# EAGLE design Jalousie_DC_up (EAGLE 5.00)
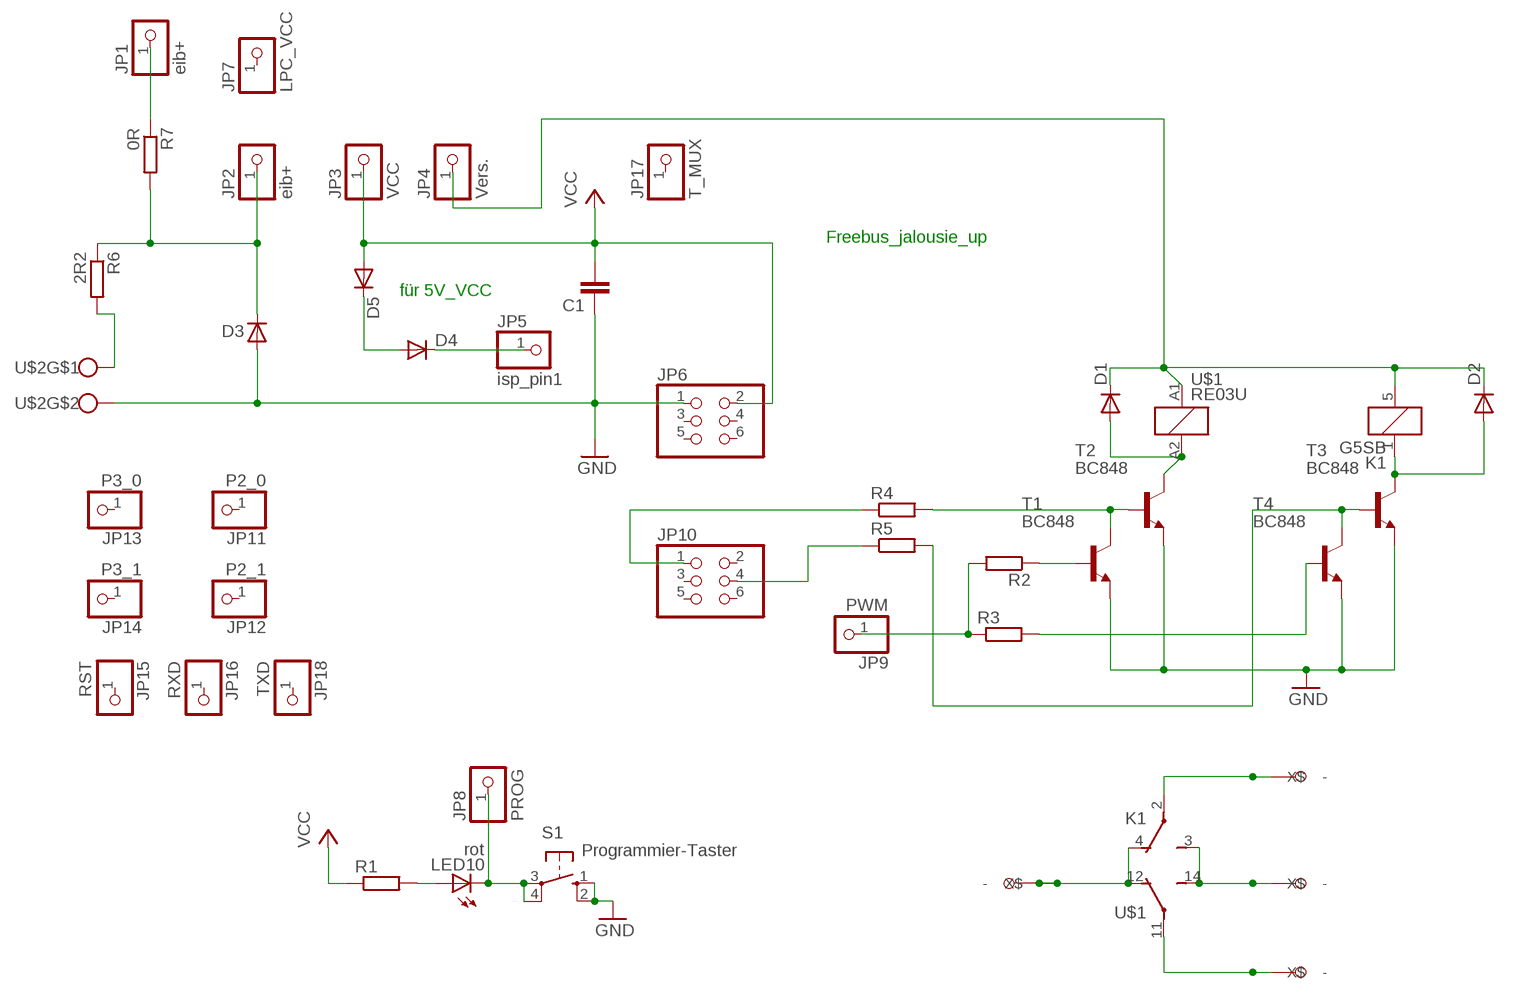
[diagram p0: schematic, sheet 1]

## Parts
C1  C-EUC1206  [C1206]
D1  DIODE-MINIMELF  [MINIMELF]
D2  DIODE-MINIMELF  [MINIMELF]
D3  D-  [SMA]
D4  DIODE-MINIMELF  [MINIMELF]
D5  DIODE-MINIMELF  [MINIMELF]
DOWN  +UB  SCHRAUBKLEMME  [SCHRAUBKLEMME_PAC]
JP1  eib+  PINHD-1X1  [1X01]
JP2  eib+  PINHD-1X1  [1X01]
JP3  VCC  PINHD-1X1  [1X01]
JP4  Vers.  PINHD-1X1  [1X01]
JP5  isp_pin1  PINHD-1X1  [1X01]
JP6  PINHD-2X3  [2X03]
JP7  LPC_VCC  PINHD-1X1  [1X01]
JP8  PROG  PINHD-1X1  [1X01]
JP9  PWM  PINHD-1X1  [1X01]
JP10  PINHD-2X3  [2X03]
JP11  P2_0  PINHD-1X1  [1X01]
JP12  P2_1  PINHD-1X1  [1X01]
JP13  P3_0  PINHD-1X1  [1X01]
JP14  P3_1  PINHD-1X1  [1X01]
JP15  RST  PINHD-1X1  [1X01]
JP16  RXD  PINHD-1X1  [1X01]
JP17  T_MUX  PINHD-1X1  [1X01]
JP18  TXD  PINHD-1X1  [1X01]
K1  G5SB  [G5SB]
L1  -UB  SCHRAUBKLEMME  [SCHRAUBKLEMME_PAC]
L2  DC-Mot  SCHRAUBKLEMME  [SCHRAUBKLEMME_PAC]
LED10  rot  LED3MM  [LED3MM]
R1  R-EU_R1206  [R1206]
R2  R-EU_R1206  [R1206]
R3  R-EU_R1206  [R1206]
R4  R-EU_R1206  [R1206]
R5  R-EU_R1206  [R1206]
R6  2R2  R-EU_R1206  [R1206]
R7  0R  R-EU_R1206  [R1206]
S1  Programmier-Taster  10-XX  [B3F-10XX]
T1  BC848  [SOT23]
T2  BC848  [SOT23]
T3  BC848  [SOT23]
T4  BC848  [SOT23]
U$1  RE03U  [G5Q_1_EU]
U$2  AKL059-02  [AKL3.5X2]
UP  DC-Mot  SCHRAUBKLEMME  [SCHRAUBKLEMME_PAC]

## Nets
GND: C1.1 D3.2(A) JP6.1 S1.1(S) S1.2(S1) T1.2(E) T2.2(E) T3.2(E) T4.2(E) U$2.2
N$2: L1.P$1(X$) L1.P$2(-) U$1.11(14:P)
N$3: DOWN.P$1(X$) DOWN.P$2(-) K1.2(U:P)
N$4: K1.4(U:O) U$1.12(14:O) UP.P$1(X$) UP.P$2(-)
N$5: D3.1(C) JP2.1 R6.1 R7.2
N$6: D2.A K1.1 T3.3(C)
N$7: JP10.1 R4.1
N$8: JP10.4 R5.1
N$9: D1.A T2.3(C) U$1.A2
N$10: D4.A D5.C
N$11: R5.2 T3.1(B) T4.3(C)
N$12: R6.2 U$2.1
N$13: R2.1 T1.1(B)
N$14: R3.2 T4.1(B)
N$15: JP9.1 R2.2 R3.1
N$16: JP1.1 R7.1
N$17: R4.2 T1.3(C) T2.1(B)
N$18: JP8.1 LED10.K(C) S1.3(P) S1.4(P1)
N$19: D4.C JP5.1
N$20: K1.3(U:S) L2.P$1(X$) L2.P$2(-) U$1.14(14:S)
N$28: D1.C D2.C JP4.1 K1.5 U$1.A1
N$62: LED10.A R1.2
VCC: C1.2 D5.A JP3.1 JP6.2 R1.1
Unconnected: JP6.3 JP6.4 JP6.5 JP6.6 JP7.1 JP10.2 JP10.3 JP10.5 JP10.6 JP11.1 JP12.1 JP13.1 JP14.1 JP15.1 JP16.1 JP17.1 JP18.1

## Notes on the sheet
- Freebus_jalousie_up
- für 5V_VCC

## Library data of the parts
C1 = rcl:C-EU: CAPACITOR, European symbol
D1 D2 D4 D5 = diode:DIODE-: DIODE
D3 = semicon-smd-ipc:D-: DIODE unfilled
DOWN L1 L2 UP = freebus:SCHRAUBKLEMME
JP1-JP5 JP7-JP9 JP11-JP18 = pinhead:PINHD-1X1: PIN HEADER
JP6 JP10 = pinhead:PINHD-2X3: PIN HEADER
K1 = relay:G5SB: Compact Single-pole Relay for Switching 5 A Source: http://www.omron.com/ecb/products/pry/121/g5sb.html
LED10 = led:LED: LED OSRAM: - CHIPLED LG R971, LG N971, LY N971, LG Q971, LY Q971, LO R971, LY R971 LH N974, LH R974 LS Q976, LO Q976, LY Q976 LO Q996 - Hyper CHIPLED LW Q18S LB Q993, LB Q99A, LB R99A - SideLED LS A670, LO A670, LY A670, LG A670, LP A670 LB A673, LV A673, LT A673, LW A673 LH A674 LY A675 LS A676, LA A676, LO A676, LY A676, LW A676 LS A679, LY A679, LG A679 - Hyper Micro SIDELED® LS Y876, LA Y876, LO Y876, LY Y876 LT Y87S - SmartLED LW L88C, LW L88S LB L89C, LB L89S, LG L890 LS L89K, LO L89K, LY L89K LS L896, LA L896, LO L896, LY L896 - TOPLED LS T670, LO T670, LY T670, LG T670, LP T670 LSG T670, LSP T670, LSY T670, LOP T670, LYG T670 LG T671, LOG T671, LSG T671 LB T673, LV T673, LT T673, LW T673 LH T674 LS T676, LA T676, LO T676, LY T676, LB T676, LH T676, LSB T676, LW T676 LB T67C, LV T67C, LT T67C, LS T67K, LO T67K, LY T67K, LW E67C LS E67B, LA E67B, LO E67B, LY E67B, LB E67C, LV E67C, LT E67C LW T67C LS T679, LY T679, LG T679 LS T770, LO T770, LY T770, LG T770, LP T770 LB T773, LV T773, LT T773, LW T773 LH T774 LS E675, LA E675, LY E675, LS T675 LS T776, LA T776, LO T776, LY T776, LB T776 LHGB T686 LT T68C, LB T68C - Hyper Mini TOPLED® LB M676 - Mini TOPLED Santana® LG M470 LS M47K, LO M47K, LY M47K Source: http://www.osram.convergy.de - LUMILED® LXK2-PW12-R00, LXK2-PW12-S00, LXK2-PW14-U00, LXK2-PW14-V00 LXK2-PM12-R00, LXK2-PM12-S00, LXK2-PM14-U00 LXK2-PE12-Q00, LXK2-PE12-R00, LXK2-PE12-S00, LXK2-PE14-T00, LXK2-PE14-U00 LXK2-PB12-K00, LXK2-PB12-L00, LXK2-PB12-M00, LXK2-PB14-N00, LXK2-PB14-P00, LXK2-PB14-Q00 LXK2-PR12-L00, LXK2-PR12-M00, LXK2-PR14-Q00, LXK2-PR14-R00 LXK2-PD12-Q00, LXK2-PD12-R00, LXK2-PD12-S00 LXK2-PH12-R00, LXK2-PH12-S00 LXK2-PL12-P00, LXK2-PL12-Q00, LXK2-PL12-R00 Source: www.luxeon.com
R1-R7 = rcl:R-EU_: RESISTOR, European symbol
S1 = switch-omron:10-XX: OMRON SWITCH
T1-T4 = transistor:BC848: NPN TRANSISTOR
U$1 = freebus_relay:RE03U
U$2 = con-wago-500:AKL059-02

## Board
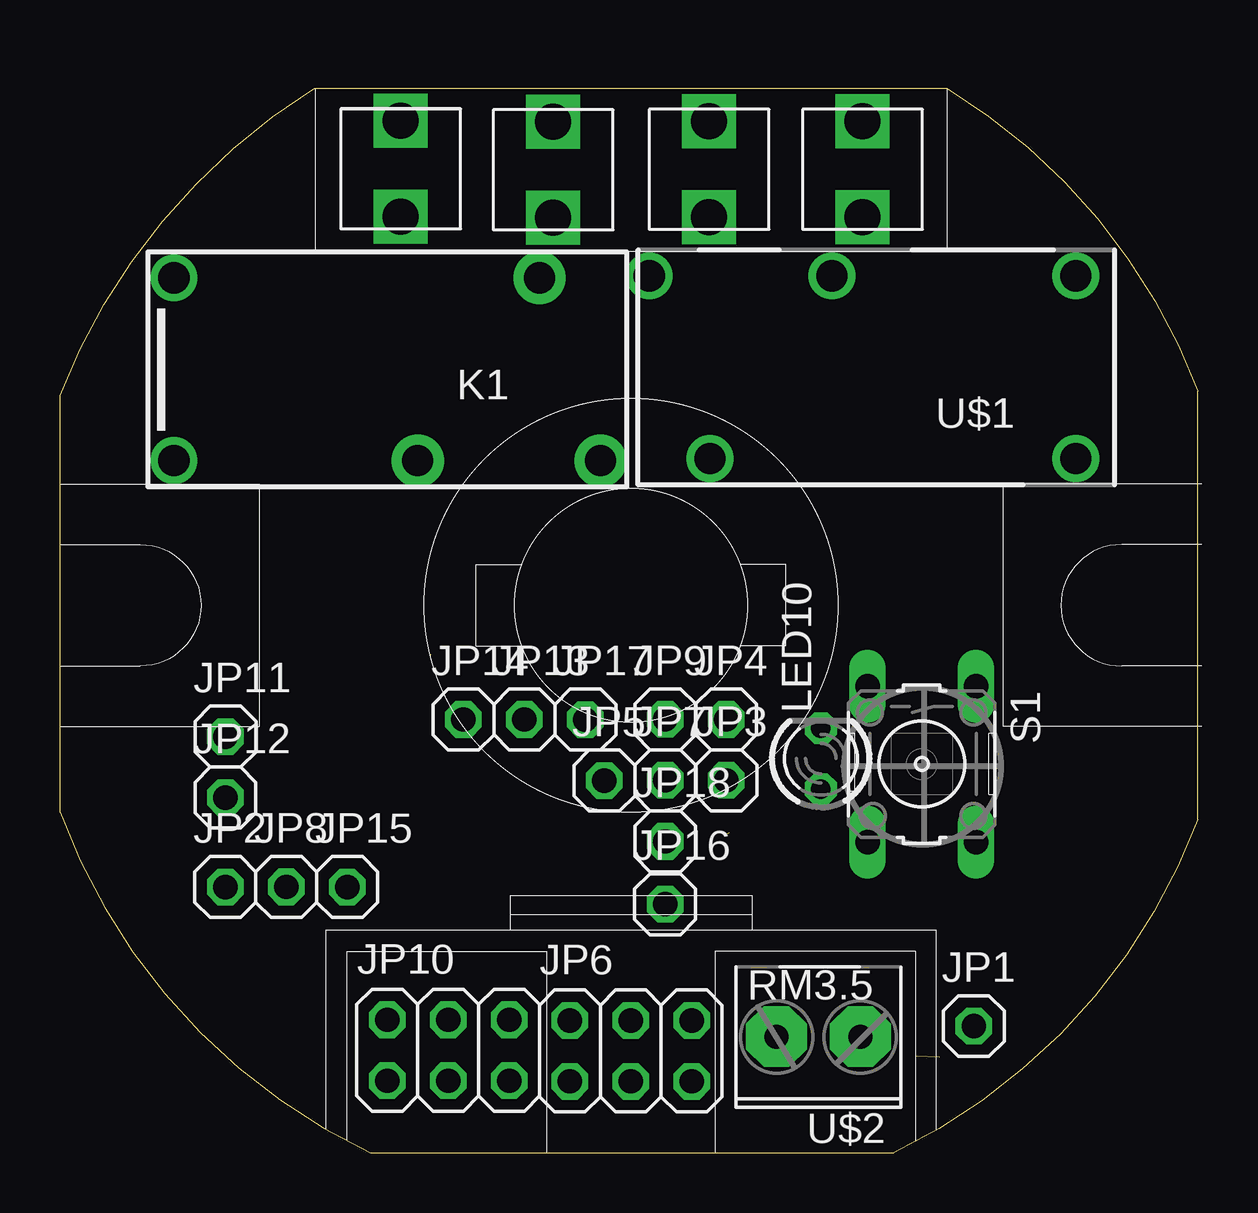
[diagram p1: board, top side]
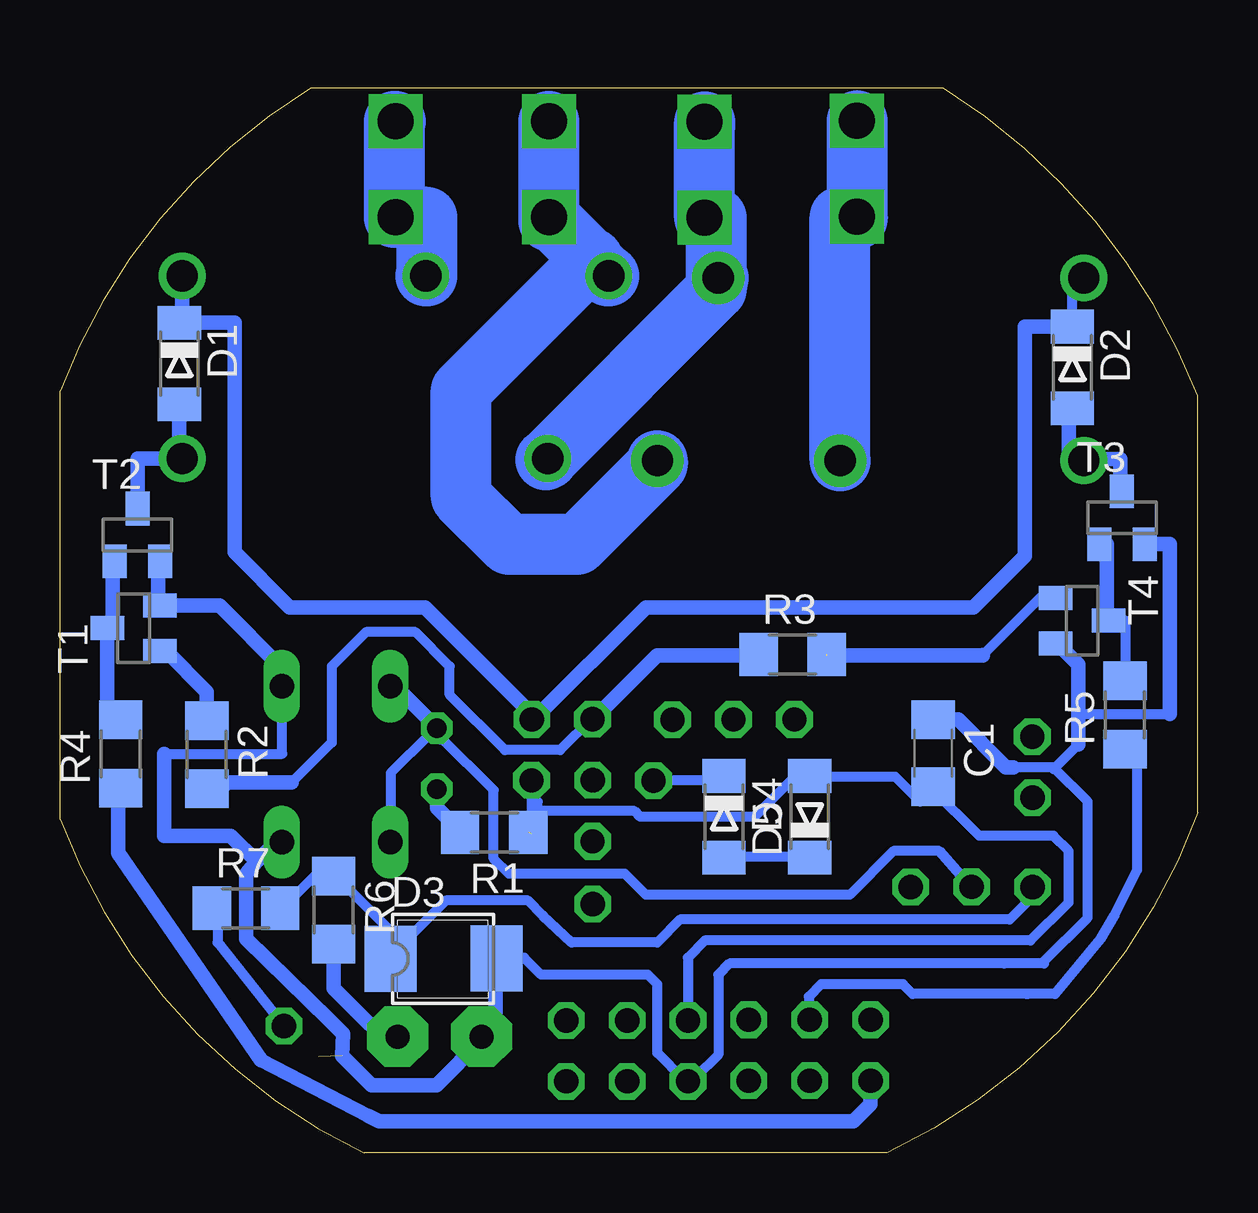
[diagram p2: board, bottom side, seen from below]

Size 47.43 x 44.38 mm. Coordinates in mm from the lower left corner, seen from the top.
Outline: 10.62,44.38 36.96,44.38
Outline: 47.42,13.9 47.43,31.75
Outline: 12.95,0 34.75,0
Outline: 12.95,0 arc-44 0,14.19 0,31.58 arc-36 10.61,44.38
Outline: 36.98,44.38 arc-38 47.43,31.76
Outline: 47.42,13.91 arc-44 34.75,0
Copper layers (1*16): Top 0.035mm / dielectric 1.5mm / Bottom 0.035mm
Design rules "default": minimum track width 10mil, minimum drill 24mil, track to track 8mil, track to pad 8mil, pad to pad 8mil, via to via 8mil, smd to smd 8mil, copper to edge 40mil, drill to drill 8mil, minimum pad ring 10mil, minimum via ring 8mil, stop-mask expansion 4mil, vias tented up to drill 0mil, thermal gap 10mil

### Footprints (pad centres in the part's own frame; a part is rotated, then mirrored left to right if it is on the bottom)
C1206 = smd 1.6 x 1.8: 1 -1.4,0; 2 1.4,0
MINIMELF = smd 1.4 x 1.8: A 1.7,0; C -1.7,0
SMB = smd 2.159 x 2.743: 1 -2.311,-0.127; 2 2.108,-0.102
SCHRAUBKLEMME_PAC = drill 1.5 pad 1.93 square: P$1 -2,0; P$2 2,0
1X01 = drill 1.016 octagon: 1 0,0
2X03 = drill 1.016 octagon: 1 -2.54,-1.27; 2 -2.54,1.27; 3 0,-1.27; 4 0,1.27; 5 2.54,-1.27; 6 2.54,1.27
G5SB = drill 1.3 pad 1.93 round: 1 7.62,3.81; 5 7.62,-3.81 | drill 1.3 pad 2.184 round: 2 -2.54,3.81; 3 -10.16,3.81; 4 -7.62,-3.81
LED3MM = drill 0.813 octagon: A -1.27,0; K 1.27,0
R1206 = smd 1.6 x 1.803: 1 -1.422,0; 2 1.422,0
B3F-10XX = drill 1.016 long: 1 -3.251,2.261; 2 3.251,2.261; 3 -3.251,-2.261; 4 3.251,-2.261
SOT23 = smd 1 x 1.4: 1 -0.95,-1.1; 2 0.95,-1.1; 3 0,1.1
G5Q_1_EU = drill 1.3 round: 11 1.27,-3.81; 12 6.35,3.81; 14 8.89,-3.81; A1 -8.89,-3.81; A2 -8.89,3.81
AKL3.5X2 = drill 1 pad 2.54 octagon: 1 -1.75,-0.1; 2 1.75,-0.1

### Placement (x,y rotation side)
C1  11.03,16.67 270 bottom
D1  42.45,32.91 270 bottom
D2  5.23,32.75 270 bottom
D3  [SMB]  31.34,8.22 0 bottom
D4  19.75,14.02 270 bottom
D5  16.18,14.02 90 bottom
DOWN  14.2,41.02 270 top
JP1  38.09,5.29 0 top
JP2  6.89,11.09 0 top
JP3  27.77,15.53 0 top
JP4  27.77,18.07 0 top
JP5  22.69,15.52 0 top
JP6  23.79,4.26 0 top
JP7  25.23,15.53 0 top
JP8  9.43,11.09 0 top
JP9  25.23,18.08 0 top
JP10  16.18,4.28 0 top
JP11  6.9,17.36 0 top
JP12  6.9,14.82 0 top
JP13  19.36,18.07 0 top
JP14  16.82,18.07 0 top
JP15  11.97,11.09 0 top
JP16  25.23,10.37 0 top
JP17  21.9,18.07 0 top
JP18  25.23,12.99 0 top
K1  12.37,32.67 180 top
L1  33.45,41 270 top
L2  27.05,41 90 top
LED10  31.72,16.44 90 top
R1  29.33,13.37 180 bottom
R2  41.31,16.6 270 bottom
R3  16.89,20.78 0 bottom
R4  44.9,16.63 90 bottom
R5  3.04,18.26 90 bottom
R6  36.02,10.13 270 bottom
R7  39.68,10.21 0 bottom
S1  35.92,16.21 270 top
T1  44.36,21.87 90 bottom
T2  44.2,25.76 0 bottom
T3  3.16,26.48 0 bottom
T4  4.83,22.19 270 bottom
U$1  33.45,32.75 180 top
U$2  31.62,4.75 180 top
UP  20.56,40.98 90 top

### Tracks (layer width: path | path; a pad name or v marks a point on that pad's centre or on a via)
GND  (1 unrouted)
  Bottom 0.406: 7.69,16.08 6.02,16.08 5.98,16.04 | 5.98,16.04 4.59,14.65 4.59,9.81 6.42,7.98 6.42,7.9 6.42,7.91 8.08,7.9 19.51,7.9 19.99,7.43 19.99,4.09 20.93,3.15 JP6.1 21.41,3.05 22.53,4.17 22.53,7.03 22.93,7.43 27.37,7.43 28.09,8.14 29.21,8.14 D3.2 | 1.18,18.3 4.99,18.3 4.99,18.22 | 5.98,16.04 6.02,16 | 5.98,16.04 | 5.98,16.04 4.99,17.03 | 5.86,21.24 T4.2 | S1.1 38.17,19.46 38.17,16.64 43.09,16.64
  Bottom 0.61: T3.2 1.18,25.38 1.18,18.3 | 4.99,17.03 4.99,18.22 4.99,20.37 5.86,21.24 | T2.2 43.33,24.66 43.33,22.82 T1.2 40.78,22.82 38.17,20.21 38.17,19.57 38.18,19.56 S1.1 | 39.24,12.15 39.67,11.64 39.67,8.94 36.18,5.52 35.63,4.97 35.67,4.05 34.44,2.82 31.74,2.82 29.83,4.73 29.83,4.82 U$2.2 29.28,5.44 29.28,8.08 D3.2 | 39.24,12.15 38.45,12.94 38.2,12.94 38.18,12.92 | 43.09,16.64 43.09,13.22 40.31,13.22 39.24,12.15 | 7.69,16.08 8,16.08 9.99,18.07 10.94,18.07 10.95,18.07 C1.1 | 38.18,12.92 38.17,12.91 | 38.18,12.92 S1.2
N$2
  Bottom 2.54: U$1.11 32.13,36.56 32.13,39 L1.P$2 33.48,39 33.48,43 L1.P$1
N$3
  Bottom 2.54: K1.2 | K1.2 14.91,39.02 DOWN.P$2 | DOWN.P$2 14.2,38.94 | DOWN.P$1 DOWN.P$2
N$4
  Bottom 2.54: 20.07,36.48 20.07,36.32 | 20.07,36.48 K1.4 20.07,36 27.18,28.89 U$1.12 | 20.07,36.48 20.07,38.98 UP.P$1 20.56,42.81 20.55,42.83 20.56,42.84 UP.P$2
N$5
  Bottom 0.406: JP2.1 6.89,10.68 7.85,9.73 21.58,9.73 22.53,8.78 26.1,8.78 27.29,9.89 27.93,10.52 31.34,10.52 33.65,8.21 D3.1 33.65,9.26 35.94,11.55 R6.1 36.82,11.55 38.17,10.21 R7.2
N$6
  Bottom 0.406: 3.24,27.51 3.24,27.58 T3.3 | 5.38,28.92 5.38,28.86 | 5.38,31.05 D2.A
  Bottom 0.61: 3.24,27.58 3.24,28.86 | 3.24,28.86 3.24,28.92 | 5.38,31.05 5.38,28.92 5.15,28.92 | 5.15,28.92 3.31,28.92 3.24,28.86 | 5.15,28.92 5.15,28.86 K1.1
N$7
  Bottom 0.61: JP10.1 13.64,2.03 14.35,1.32 34.12,1.32 34.59,1.55 39.04,3.86 44.99,12.51 44.99,14.65 R4.1
N$8
  Bottom 0.406: JP10.4 16.18,5.68 16.22,6.52 15.7,7.03 12.29,7.03 11.89,6.63 7.13,6.63 | 7.13,6.63 7.1,6.63 | 2.53,13.54 2.53,11.79 3.48,9.89 4.04,8.94 5.94,6.63 7.13,6.63 | 2.53,13.54 2.53,13.62 | R5.1 2.53,16.84 2.53,13.54
N$9
  Bottom 0.61: 42.34,28.9 42.29,28.86 | 42.34,28.9 U$1.A2 44.2,28.94 T2.3 | D1.A 42.45,29.02 42.34,28.9 | T2.3
N$10
  Bottom 0.406: D4.A 19.72,12.35 16.21,12.35 D5.C
N$11
  Bottom 0.406: R5.2 3,19.68 3,22.19 T4.3 3.8,22.19 | 3.8,25.38 T3.1
  Bottom 0.61: 3.8,22.19 3.8,25.38
N$12
  Bottom 0.61: R6.2 36.02,6.87 34.52,5.36 33.88,5.36 U$2.1
N$13
  Bottom 0.61: T1.1 43.01,20.93 41.31,19.22 R2.1
N$14  (1 unrouted)
  Bottom 0.406: T4.1 6.58,23.14 8.96,20.76
  Bottom 0.61: 15.45,20.75 8.97,20.75 8.96,20.76
N$15
  Bottom 0.406: JP9.1 25.23,18.46 | 25.15,18.54 25.23,18.14 26.58,16.8 28.88,16.79 31.18,19.1 31.18,20.29 32.61,21.72 34.67,21.72 36.1,20.29 36.1,17.11 37.77,15.45
  Bottom 0.61: JP9.1 | JP9.1 24.75,18.54 22.54,20.75 18.5,20.75 18.4,20.84 18.34,20.78 R3.1 | 25.15,18.54 25.22,18.47 JP9.1 | R2.2 41.24,14.78 41.18,14.73 40.47,15.45 37.77,15.45
N$16
  Bottom 0.406: R7.1 40.87,9.98 40.87,8.78 JP1.1
N$17
  Bottom 0.61: 45.23,21.88 | 45.23,21.88 T1.3 45.46,18.53 44.83,17.91 44.9,17.84 R4.2 | T2.1 45.23,24.66 45.23,21.88
N$18
  Bottom 0.406: 32.03,17.45 33.64,15.84 33.64,13.14 | 31.56,17.33 29.36,15.13 29.36,12.27 28.72,11.64 23.88,11.64 23.01,10.76 14.51,10.76 12.69,12.59 10.78,12.59 9.43,11.08 | 9.43,11.08 | JP8.1 9.43,11.08
  Bottom 0.61: 32.03,17.45 31.77,17.71 LED10.K 31.72,17.73 31.74,17.75 | S1.3 33.45,19.46 31.74,17.75 | 31.56,17.33 31.56,17.57 31.74,17.75 | S1.4 33.66,13.05 33.64,13.06 33.64,13.14
N$19
  Bottom 0.406: D4.C 19.94,15.52 JP5.1
N$20
  Bottom 2.54: L2.P$2 L2.P$1 27.05,38.94 27.05,38.86 26.9,38.86 25.27,37.23 | U$1.14 24.59,36.56 25.27,37.23 | K1.3 22.53,28.7 25.86,25.37 28.72,25.37 30.71,27.35 30.71,31.8 25.27,37.23 | 25.27,37.23 25.23,37.27
N$28
  Bottom 0.406: D2.C 5.23,34.34 | D2.C | D2.C 5.23,36.54 | 15.54,22.75
  Bottom 0.61: D2.C 7.21,34.45 7.21,24.89 9.35,22.75 15.54,22.75 23.01,22.75 27.69,18.07 27.7,18.07 JP4.1 27.77,18.3 32.21,22.75 37.69,22.75 37.85,22.75 37.89,22.79 | 42.45,34.49 | 42.45,34.49 D1.C 40.15,34.61 40.15,25.05 37.89,22.79 | U$1.A1 42.34,34.61 42.45,34.49 | 37.89,22.79 | K1.5 | 5.23,36.54 4.81,36.54 K1.5
N$62
  Bottom 0.61: R1.2 30.75,13.43 31.72,14.39 LED10.A
VCC  (1 unrouted)
  Bottom 0.406: JP6.2 21.42,5.53 21.26,5.6 21.26,8.14 20.55,8.86 6.97,8.86 5.38,10.45 5.38,12.59 6.02,13.22 9.12,13.22 11.1,15.21 C1.2 | 27.88,13.2 27.93,13.14 | 27.88,13.2 27.72,13.24 | 27.77,14.81 27.77,13.3 27.88,13.2 | 27.77,14.81 JP3.1 | 27.77,14.81 27.61,14.81 27.52,14.64 | C1.2 11,15.27 | C1.2 11.03,15.2 11.58,14.65 12.61,15.68 16.15,15.68 D5.A 16.21,15.68 16.81,15.68 18.48,14.02 23.24,14.02 23.48,14.25 27.53,14.25 27.52,14.64 | 27.52,14.64

### Text on the board
tDocu: +UB | DC-Mot | DC-Mot | -UB